# EAGLE design Programmer (EAGLE 9.1.0)
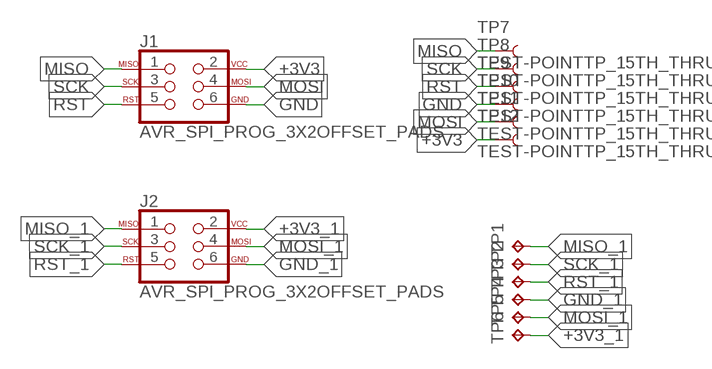
[diagram p0: schematic, sheet 1]

## Parts
J1  AVR_SPI_PROG_3X2OFFSET_PADS  [2X3_OFFSET]
J2  AVR_SPI_PROG_3X2OFFSET_PADS  [2X3_OFFSET]
TP1  TPTP12SQ  [TP12SQ]
TP2  TPTP12SQ  [TP12SQ]
TP3  TPTP12SQ  [TP12SQ]
TP4  TPTP12SQ  [TP12SQ]
TP5  TPTP12SQ  [TP12SQ]
TP6  TPTP12SQ  [TP12SQ]
TP7  TEST-POINTTP_15TH_THRU  [TP_15TH]
TP8  TEST-POINTTP_15TH_THRU  [TP_15TH]
TP9  TEST-POINTTP_15TH_THRU  [TP_15TH]
TP10  TEST-POINTTP_15TH_THRU  [TP_15TH]
TP11  TEST-POINTTP_15TH_THRU  [TP_15TH]
TP12  TEST-POINTTP_15TH_THRU  [TP_15TH]

## Nets
+3V3: J1.2 TP12.P$1
+3V3_1: J2.2 TP6.TP
GND: J1.6 TP10.P$1
GND_1: J2.6 TP4.TP
MISO: J1.1 TP7.P$1
MISO_1: J2.1 TP1.TP
MOSI: J1.4 TP11.P$1
MOSI_1: J2.4 TP5.TP
RST: J1.5 TP9.P$1
RST_1: J2.5 TP3.TP
SCK: J1.3 TP8.P$1
SCK_1: J2.3 TP2.TP

## Library data of the parts
J1 J2 = SparkFun-Connectors:AVR_SPI_PROG_3X2: AVR ISP 6 Pin This is the reduced ISP connector for AVR programming. Common on Arduino. This footprint will take up less PCB space and can be used with a 10-pin to 6-pin adapter such as SKU: BOB-08508 **Special note about "TEST_POINT" package. The stop mask is on the top side, so if you want your programming test points to be on the bottom of your board, make sure to place this package on the bottom side of the board. This also ensure that the orientation to program from the bottom side will be correct. SparkFun Products: SparkFun ISP Pogo Adapter <https://www.sparkfun.com/products/11591> - NS Tiny AVR Programmer <https://www.sparkfun.com/products/11801> -PTH
TP1-TP6 = testpad:TP: Test pad
TP7-TP12 = SparkFun-Connectors:TEST-POINT: SparkFun Test Points Bare copper test points for troubleshooting or In-Circuit-Testing. These are used by our Production team for verifying production board runs using pogo-pins on test beds. SparkFun Products: SparkFun LSM9DS1 Breakout <https://www.sparkfun.com/products/13284> SparkFun PSOC <https://www.sparkfun.com/products/13714> SparkFun Load Cell Amplifier <https://www.sparkfun.com/products/13879>

## Board
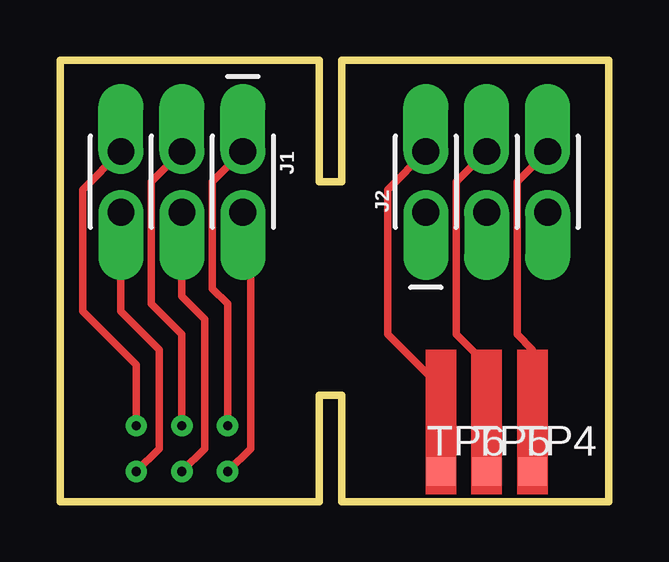
[diagram p1: board, top side]
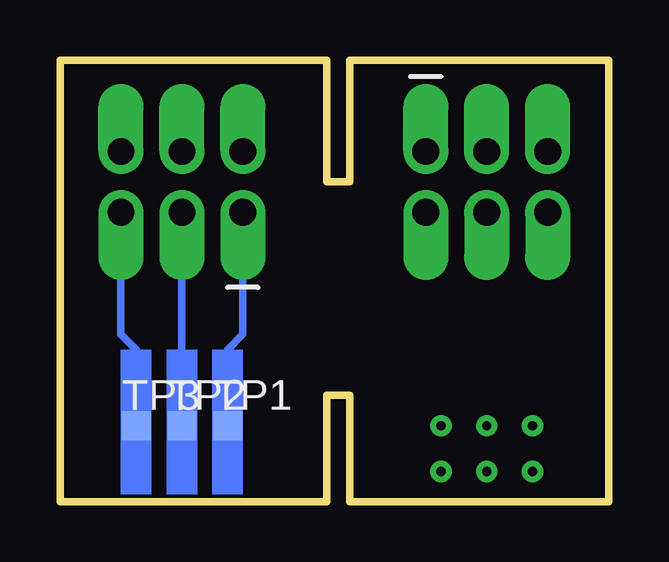
[diagram p2: board, bottom side, seen from below]

Size 22.86 x 18.41 mm. Coordinates in mm from the lower left corner, seen from the top.
Outline: 0,0 10.79,0 10.79,4.45 11.75,4.45 11.75,0 22.86,0 22.86,18.41 11.75,18.41 11.75,13.34 10.79,13.34 10.79,18.41 0,18.41 0,0
Copper layers (1*16): Top 0.035mm / dielectric 1.5mm / Bottom 0.035mm
Design rules "default *": minimum track width 6mil, minimum drill 0.35mm, track to track 6mil, track to pad 6mil, pad to pad 6mil, via to via 6mil, smd to smd 6mil, copper to edge 20mil, drill to drill 6mil, minimum pad ring 10mil, minimum via ring 8mil, stop-mask expansion 4mil, vias tented up to drill 0mil, thermal gap 10mil

### Footprints (pad centres in the part's own frame; a part is rotated, then mirrored left to right if it is on the bottom)
2X3_OFFSET = drill 1.118 pad 1.88 offset: 1 -2.54,-1.27; 2 -2.54,1.27; 3 0,-1.27; 4 0,1.27; 5 2.54,-1.27; 6 2.54,1.27
TP12SQ = smd 1.2 x 1.2: TP 0,0
TP_15TH = drill 0.381 pad 0.61: P$1 0,0

### Placement (x,y rotation side)
J1  5.08,13.34 180 top
J2  17.78,13.34 0 top
TP1  15.88,3.18 0 bottom
TP2  17.78,3.18 0 bottom
TP3  19.69,3.18 0 bottom
TP4  19.69,1.27 0 top
TP5  17.78,1.27 0 top
TP6  15.88,1.27 0 top
TP7  6.98,3.18 0 top
TP8  5.08,3.18 0 top
TP9  3.17,3.18 0 top
TP10  3.17,1.27 0 top
TP11  5.08,1.27 0 top
TP12  6.98,1.27 0 top

### Tracks (layer width: path | path; a pad name or v marks a point on that pad's centre or on a via)
+3V3
  Top 0.305: J1.2 7.94,11.75 7.94,2.22 TP12.P$1
+3V3_1
  Top 0.305: J2.2 13.65,13.02 13.65,6.98 15.88,4.76 TP6.TP
GND
  Top 0.305: J1.6 2.54,7.94 4.13,6.35 4.13,2.22 TP10.P$1
GND_1
  Top 0.305: J2.6 19.05,13.34 19.05,6.98 19.69,6.35 TP4.TP
MISO
  Top 0.305: J1.1 6.35,13.34 6.35,8.89 6.98,8.26 TP7.P$1
MISO_1
  Bottom 0.305: J2.1 15.24,6.98 15.88,6.35 TP1.TP
MOSI
  Top 0.305: TP11.P$1 6.03,2.22 6.03,7.62 5.08,8.57 J1.4
MOSI_1
  Top 0.305: J2.4 16.51,13.34 16.51,6.98 17.78,5.71 TP5.TP
RST
  Top 0.305: J1.5 0.95,13.02 0.95,7.94 3.17,5.71 TP9.P$1
RST_1
  Bottom 0.305: J2.5 20.32,6.98 19.69,6.35 TP3.TP
SCK
  Top 0.305: J1.3 3.81,13.34 3.81,8.26 5.08,6.98 TP8.P$1
SCK_1
  Bottom 0.305: J2.3 TP2.TP
(copper drawn outside any net)
  shapes: Bottom area x3, Top area x3